# Altium schematic sheet MotorBoard.SchDoc
size Tabloid; SheetNumber: 1; SheetTotal: 1
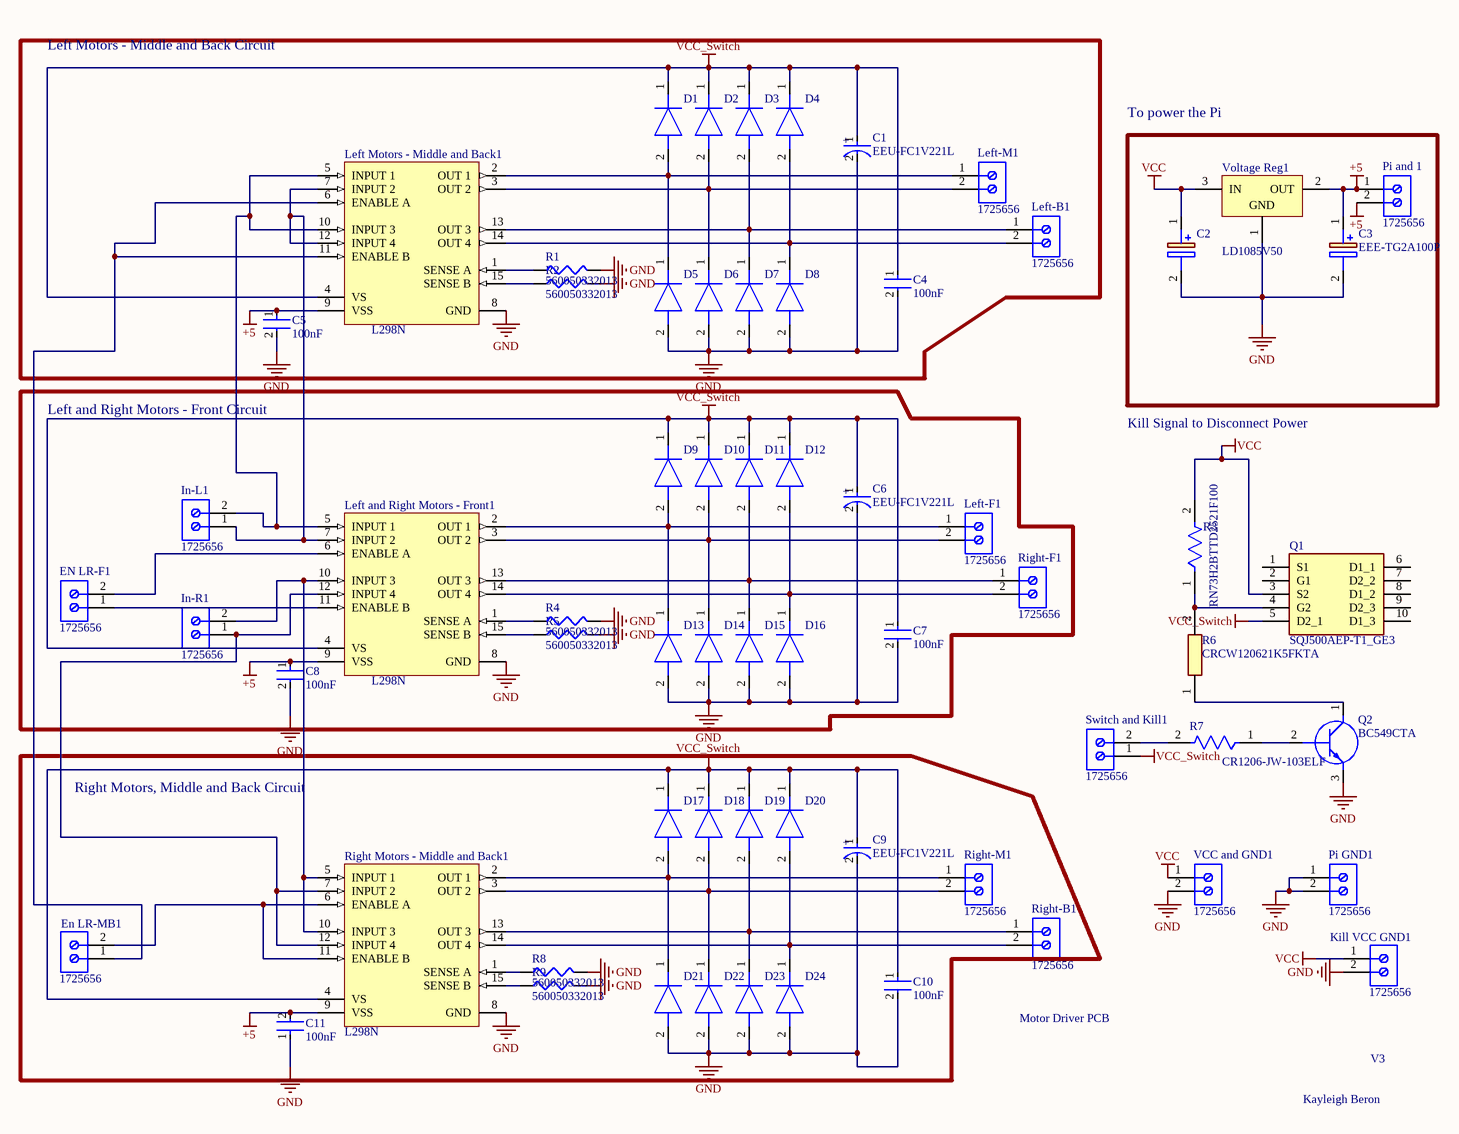
[diagram p0: MotorBoard.SchDoc]

## Parts
C1  EEU-FC1V221L  [FP-EEU-FC1V221L-MFG]
C2  EEE-TG2A100P  [CAPAE830X1050N]  (value not drawn)
C3  EEE-TG2A100P  [CAPAE830X1050N]
C4  100nF  [FP-C2012-125-0_2-MFG]
C5  100nF  [FP-C2012-125-0_2-MFG]
C6  EEU-FC1V221L  [FP-EEU-FC1V221L-MFG]
C7  100nF  [FP-C2012-125-0_2-MFG]
C8  100nF  [FP-C2012-125-0_2-MFG]
C9  EEU-FC1V221L  [FP-EEU-FC1V221L-MFG]
C10  100nF  [FP-C2012-125-0_2-MFG]
C11  100nF  [FP-C2012-125-0_2-MFG]
D1  CMR1U-02M_TR13_PBFREE  [DIOM5226X262N]  (value not drawn)
D2  CMR1U-02M_TR13_PBFREE  [DIOM5226X262N]  (value not drawn)
D3  CMR1U-02M_TR13_PBFREE  [DIOM5226X262N]  (value not drawn)
D4  CMR1U-02M_TR13_PBFREE  [DIOM5226X262N]  (value not drawn)
D5  CMR1U-02M_TR13_PBFREE  [DIOM5226X262N]  (value not drawn)
D6  CMR1U-02M_TR13_PBFREE  [DIOM5226X262N]  (value not drawn)
D7  CMR1U-02M_TR13_PBFREE  [DIOM5226X262N]  (value not drawn)
D8  CMR1U-02M_TR13_PBFREE  [DIOM5226X262N]  (value not drawn)
D9  CMR1U-02M_TR13_PBFREE  [DIOM5226X262N]  (value not drawn)
D10  CMR1U-02M_TR13_PBFREE  [DIOM5226X262N]  (value not drawn)
D11  CMR1U-02M_TR13_PBFREE  [DIOM5226X262N]  (value not drawn)
D12  CMR1U-02M_TR13_PBFREE  [DIOM5226X262N]  (value not drawn)
D13  CMR1U-02M_TR13_PBFREE  [DIOM5226X262N]  (value not drawn)
D14  CMR1U-02M_TR13_PBFREE  [DIOM5226X262N]  (value not drawn)
D15  CMR1U-02M_TR13_PBFREE  [DIOM5226X262N]  (value not drawn)
D16  CMR1U-02M_TR13_PBFREE  [DIOM5226X262N]  (value not drawn)
D17  CMR1U-02M_TR13_PBFREE  [DIOM5226X262N]  (value not drawn)
D18  CMR1U-02M_TR13_PBFREE  [DIOM5226X262N]  (value not drawn)
D19  CMR1U-02M_TR13_PBFREE  [DIOM5226X262N]  (value not drawn)
D20  CMR1U-02M_TR13_PBFREE  [DIOM5226X262N]  (value not drawn)
D21  CMR1U-02M_TR13_PBFREE  [DIOM5226X262N]  (value not drawn)
D22  CMR1U-02M_TR13_PBFREE  [DIOM5226X262N]  (value not drawn)
D23  CMR1U-02M_TR13_PBFREE  [DIOM5226X262N]  (value not drawn)
D24  CMR1U-02M_TR13_PBFREE  [DIOM5226X262N]  (value not drawn)
EN_LR-F1  1725656  [PHOE-1725656-2]
En_LR-MB1  1725656  [PHOE-1725656-2]
In-L1  1725656  [PHOE-1725656-2]
In-R1  1725656  [PHOE-1725656-2]
Kill_VCC_GND1  1725656  [PHOE-1725656-2]
Left-B1  1725656  [PHOE-1725656-2]
Left-F1  1725656  [PHOE-1725656-2]
Left-M1  1725656  [PHOE-1725656-2]
Left_and_Right_Motors_-_Front1  L298N  [STM-FM-15]
Left_Motors_-_Middle_and_Back1  L298N  [STM-FM-15]
Pi_and_1  1725656  [PHOE-1725656-2]
Pi_GND1  1725656  [PHOE-1725656-2]
Q1  SQJ500AEP-T1_GE3  [SQJB02ELPT1_GE3]
Q2  BC549CTA  [BC33740TA]
R1  560050332013  [WRIS-KSKE_1206_L3.1W1.6H0.6]
R2  560050332013  [WRIS-KSKE_1206_L3.1W1.6H0.6]
R3  RN73H2BTTD2521F100  [FP-CR1206-IPC_B]
R4  560050332013  [WRIS-KSKE_1206_L3.1W1.6H0.6]
R5  560050332013  [WRIS-KSKE_1206_L3.1W1.6H0.6]
R6  CRCW120621K5FKTA  [RESC3216X60N]
R7  CR1206-JW-103ELF  [FP-CR1206-IPC_B]
R8  560050332013  [WRIS-KSKE_1206_L3.1W1.6H0.6]
R9  560050332013  [WRIS-KSKE_1206_L3.1W1.6H0.6]
Right-B1  1725656  [PHOE-1725656-2]
Right-F1  1725656  [PHOE-1725656-2]
Right-M1  1725656  [PHOE-1725656-2]
Right_Motors_-_Middle_and_Back1  L298N  [STM-FM-15]
Switch_and_Kill1  1725656  [PHOE-1725656-2]
VCC_and_GND1  1725656  [PHOE-1725656-2]
Voltage_Reg1  LD1085V50  [TO220]

## Blocks framed on the sheet
Left Motors - Middle and Back Circuit: C1 C4 C5 D1-D8 Left-B1 Left-M1 Left_Motors_-_Middle_and_Back1 R1 R2
To power the Pi: C2 C3 Pi_and_1 Voltage_Reg1
Left and Right Motors - Front Circuit: C6-C8 D9-D16 EN_LR-F1 In-L1 In-R1 Left-F1 Left_and_Right_Motors_-_Front1 R4 R5 Right-F1
Right Motors, Middle and Back Circuit: C9-C11 D17-D24 En_LR-MB1 R8 R9 Right-B1 Right-M1 Right_Motors_-_Middle_and_Back1

## Nets
+5: C3.1(+) C5.1 C8.1 C11.2 Left_and_Right_Motors_-_Front1.9(VSS) Left_Motors_-_Middle_and_Back1.9(VSS) Pi_and_1.1 Pi_and_1.2 Right_Motors_-_Middle_and_Back1.9(VSS) Voltage_Reg1.2(OUT)
GND: C1.2(A) C2.2(-) C3.2(-) C4.2 C5.2 C6.2(A) C7.2 C8.2 C9.2(A) C10.2 C11.1 D5.2(A) D6.2(A) D7.2(A) D8.2(A) D13.2(A) D14.2(A) D15.2(A) D16.2(A) D21.2(A) D22.2(A) D23.2(A) D24.2(A) Kill_VCC_GND1.2 Left_and_Right_Motors_-_Front1.8(GND) Left_Motors_-_Middle_and_Back1.8(GND) Pi_GND1.1 Pi_GND1.2 Q2.3(E) R1.2 R2.2 R4.2 R5.2 R8.2 R9.2 Right_Motors_-_Middle_and_Back1.8(GND) VCC_and_GND1.2 Voltage_Reg1.1(GND)
VCC: C2.1(+) Kill_VCC_GND1.1 Q1.3(S2) R3.2 VCC_and_GND1.1 Voltage_Reg1.3(IN)
VCC_Switch: C1.1(C) C4.1 C6.1(C) C7.1 C9.1(C) C10.1 D1.1(K) D2.1(K) D3.1(K) D4.1(K) D9.1(K) D10.1(K) D11.1(K) D12.1(K) D17.1(K) D18.1(K) D19.1(K) D20.1(K) Left_and_Right_Motors_-_Front1.4(VS) Left_Motors_-_Middle_and_Back1.4(VS) Q1.5(D2_1) Right_Motors_-_Middle_and_Back1.4(VS) Switch_and_Kill1.1
NetD1_2: D1.2(A) D5.1(K) Left-M1.1 Left_Motors_-_Middle_and_Back1.2(OUT_1)
NetD2_2: D2.2(A) D6.1(K) Left-M1.2 Left_Motors_-_Middle_and_Back1.3(OUT_2)
NetD3_2: D3.2(A) D7.1(K) Left-B1.1 Left_Motors_-_Middle_and_Back1.13(OUT_3)
NetD4_2: D4.2(A) D8.1(K) Left-B1.2 Left_Motors_-_Middle_and_Back1.14(OUT_4)
NetD9_2: D9.2(A) D13.1(K) Left-F1.1 Left_and_Right_Motors_-_Front1.2(OUT_1)
NetD10_2: D10.2(A) D14.1(K) Left-F1.2 Left_and_Right_Motors_-_Front1.3(OUT_2)
NetD11_2: D11.2(A) D15.1(K) Left_and_Right_Motors_-_Front1.13(OUT_3) Right-F1.1
NetD12_2: D12.2(A) D16.1(K) Left_and_Right_Motors_-_Front1.14(OUT_4) Right-F1.2
NetD17_2: D17.2(A) D21.1(K) Right-M1.1 Right_Motors_-_Middle_and_Back1.2(OUT_1)
NetD18_2: D18.2(A) D22.1(K) Right-M1.2 Right_Motors_-_Middle_and_Back1.3(OUT_2)
NetD19_2: D19.2(A) D23.1(K) Right-B1.1 Right_Motors_-_Middle_and_Back1.13(OUT_3)
NetD20_2: D20.2(A) D24.1(K) Right-B1.2 Right_Motors_-_Middle_and_Back1.14(OUT_4)
NetEN_LR-F1_1: EN_LR-F1.1 Left_and_Right_Motors_-_Front1.11(ENABLE_B)
NetEN_LR-F1_2: EN_LR-F1.2 Left_and_Right_Motors_-_Front1.6(ENABLE_A)
NetEn_LR-MB1_1: En_LR-MB1.1 Left_Motors_-_Middle_and_Back1.6(ENABLE_A) Left_Motors_-_Middle_and_Back1.11(ENABLE_B)
NetEn_LR-MB1_2: En_LR-MB1.2 Right_Motors_-_Middle_and_Back1.6(ENABLE_A) Right_Motors_-_Middle_and_Back1.11(ENABLE_B)
NetIn-L1_1: In-L1.1 Left_and_Right_Motors_-_Front1.7(INPUT_2) Left_Motors_-_Middle_and_Back1.7(INPUT_2) Left_Motors_-_Middle_and_Back1.12(INPUT_4)
NetIn-L1_2: In-L1.2 Left_and_Right_Motors_-_Front1.5(INPUT_1) Left_Motors_-_Middle_and_Back1.5(INPUT_1) Left_Motors_-_Middle_and_Back1.10(INPUT_3)
NetIn-R1_1: In-R1.1 Left_and_Right_Motors_-_Front1.12(INPUT_4) Right_Motors_-_Middle_and_Back1.7(INPUT_2) Right_Motors_-_Middle_and_Back1.12(INPUT_4)
NetIn-R1_2: In-R1.2 Left_and_Right_Motors_-_Front1.10(INPUT_3) Right_Motors_-_Middle_and_Back1.5(INPUT_1) Right_Motors_-_Middle_and_Back1.10(INPUT_3)
NetLeft_and_Right_Motors_-_Front1_1: Left_and_Right_Motors_-_Front1.1(SENSE_A) R4.1
NetLeft_and_Right_Motors_-_Front1_15: Left_and_Right_Motors_-_Front1.15(SENSE_B) R5.1
NetLeft_Motors_-_Middle_and_Back1_1: Left_Motors_-_Middle_and_Back1.1(SENSE_A) R1.1
NetLeft_Motors_-_Middle_and_Back1_15: Left_Motors_-_Middle_and_Back1.15(SENSE_B) R2.1
NetQ1_4: Q1.4(G2) R3.1 R6.2
NetQ2_1: Q2.1(C) R6.1
NetQ2_2: Q2.2(B) R7.1
NetR7_2: R7.2 Switch_and_Kill1.2
NetR8_1: R8.1 Right_Motors_-_Middle_and_Back1.1(SENSE_A)
NetR9_1: R9.1 Right_Motors_-_Middle_and_Back1.15(SENSE_B)

Not connected (* = marked no-connect by the designer): Q1 1(S1) 2(G1) 6(D1_1) 7(D2_2) 8(D1_2) 9(D2_3) 10(D1_3)

## Notes on the sheet
- Kill Signal to Disconnect Power
- Motor Driver PCB
- V3
- Kayleigh Beron
- (in symbol CMP-05427-000010-1) +

## Library data of the parts
C1 C6 C9 = CMP-05427-000010-1: CAP ALUM 220UF 20% 35V RADIAL; Manufacturer: Panasonic Electronic Components; Material: Aluminum; Leakage Current: 77uA; Esr: 0.085Ω; Life: 2000Hours; Automotive Grade: Grade 2; Dissipation Factor: 12%; Ripple Current: 730mA; Octopart: https://octopart.com/eeu-fc1v221l-panasonic-39478519; ComponentLink2URL: https://industrial.panasonic.com/cdbs/www-data/pdf/RDF0000/ABA0000C1209.pdf; Package: 0; Height: 16.5mm; Category: Cap; Value: 220uF; ComponentLink2Description: Datasheet; Lead Free: Yes; Device Class L2: Capacitors; Temperature Range High: +105°C; Mouser Description: Capacitor; Aluminum Electrolytic; Fc Radial Elec Cap 220uF 35V; Temperature: -55°C to +105°C; Digikey Description: CAP ALUM 220UF 20% 35V RADIAL; Device Class L3: Aluminum Electrolytic Capacitors; Manufacturer Part Number: EEU-FC1V221L; Device Class L1: Passive Components; Automotive: Yes; RoHS: TRUE; Temperature Range Low: -55°C; Capacitance: 220uF; Voltage Rating: 35V; Tolerance: 20%
C2 C3 = EEE-TG2A100P: Capacitor Polarised; Manufacturer_Name: Panasonic; Datasheet Link: http://industrial.panasonic.com/cdbs/www-data/pdf/RDE0000/ABA0000C1187.pdf; Height: 10.5mm; Manufacturer_Part_Number: EEE-TG2A100P; Mouser Part Number: 667-EEE-TG2A100P; Mouser Price/Stock: https://www.mouser.co.uk/ProductDetail/Panasonic/EEE-TG2A100P?qs=aAAGLDy8P2zc4TwQCeoTrg%3D%3D; Arrow Part Number: EEE-TG2A100P; Arrow Price/Stock: https://www.arrow.com/en/products/eee-tg2a100p/panasonic?region=nac
C4 C5 C7 C8 C10 C11 = CMP-08246-005122-1: Multilayer Ceramic Capacitors 100nF ±10% 50V X8R SMD 0805; Case/Package: 0805; Dielectric: X8R; Case Code (Metric): 2012; Height: 1.25mm; REACH SVHC: No SVHC; Capacitance: 100nF; Series: C; Voltage Rating (DC): 50V; Tolerance: 10%; Depth: 1.25mm; Voltage Rating: 50V; Thickness: 0.057inch; RoHS Compliant: Yes; Termination: SMD/SMT; Weight: 0.000194oz; Width: 0.049inch; Mount: Surface Mount; Max Operating Temperature: 150°C; Features: High Temperature; Min Operating Temperature: -55°C; Lead Free: Lead Free; Packaging: Tape and Reel; Resistor Type: Ceramic; Case Code (Imperial): 0805; Package Quantity: 1; Length: 2mm
D1-D24 = CMR1U-02M_TR13_PBFREE: Diode; Manufacturer_Name: Central Semiconductor; Manufacturer_Part_Number: CMR1U-02M TR13 PBFREE; Datasheet Link: https://my.centralsemi.com/datasheets/CMR1U01M.PDF; Height: 2.62mm; Mouser Part Number: 610-CMR1U-02M; Mouser Price/Stock: https://www.mouser.co.uk/ProductDetail/Central-Semiconductor/CMR1U-02M-TR13-PBFREE?qs=u16ybLDytRYak6CMIjk9oA%3D%3D; Arrow Part Number: CMR1U-02M TR13 PBFREE; Arrow Price/Stock: https://www.arrow.com/en/products/cmr1u-02m-tr13-pbfree/central-semiconductor?region=nac
EN_LR-F1 En_LR-MB1 In-L1 In-R1 Kill_VCC_GND1 Left-B1 Left-F1 Left-M1 Pi_and_1 Pi_GND1 Right-B1 Right-F1 Right-M1 Switch_and_Kill1 VCC_and_GND1 = CMP-2000-05299-1: Male Header, Pitch 2.54 mm, 1 x 2 Position, Height 9 mm, Tail Length 3.5 mm; Manufacturer: Phoenix Contact; Number of contacts: 2; Content: 250pc(s); Pitch: 2.54mm; Industrial packaging: Yes; Colour: Green; Manufacturer part No.: 1725656; Type: MPT0,5/2-2,54; Datasheet URL: http://datasheet.octopart.com/1725656-Phoenix-Contact-datasheet-5302866.pdf; Manufacturer URL: http://www.phoenixcontact.com/; Datasheet Version: Apr-08
Left_and_Right_Motors_-_Front1 Left_Motors_-_Middle_and_Back1 Right_Motors_-_Middle_and_Back1 = CMP-2000-06526-1: Dual Full-Bridge Driver, 4.8 to 46 V, -40 to 150 degC, 15-Pin FM (MW 15L), RoHS, Tube; Manufacturer: STMicroelectronics; PartNumber: L298; Output Current: 2A; Supply Voltage Max: 7V; Driver Case Style: Multiwatt; Supply Voltage Min: 4.5V; No. of Pins: 15Pins; SVHC: NoSVHC(17-Dec-2015); Output Voltage: 46V; No. of Outputs: 4Outputs; Motor Type: FullBridge; MSL: -; Package Description: 15-Pin Flange Mount, Body 5 x 19.6 mm, Pitch 1.27 mm; Datasheet Version: 01/2000; Package Reference: FM-15; Mounting Technology: ThroughHole; Packaging: Each; Automotive Qualification Standard: -; Product Range: -; Datasheet URL: https://datasheet.ciiva.com/15109/getdatasheetpartid-50682-15109332.pdf; Operating Temperature Max: 130°C; Operating Temperature Min: -25°C; Manufacturer URL: http://www.st.com/
Q1 = SQJ500AEP-T1_GE3: MOSFET (N-Channel); Manufacturer_Name: Vishay; Datasheet Link: http://www.mouser.com/ds/2/427/sqj500aep-740737.pdf; Height: 1.267mm; Manufacturer_Part_Number: SQJ500AEP-T1_GE3; Mouser Part Number: 78-SQJ500AEP-T1_GE3; Mouser Price/Stock: https://www.mouser.com/Search/Refine.aspx?Keyword=78-SQJ500AEP-T1_GE3
Q2 = BC549CTA: Transistor BJT NPN; Manufacturer_Name: onsemi; Datasheet Link: https://www.onsemi.com/pub/Collateral/BC550-D.pdf; Manufacturer_Part_Number: BC549CTA; Mouser Part Number: 512-BC549CTA; Mouser Price/Stock: https://www.mouser.co.uk/ProductDetail/onsemi-Fairchild/BC549CTA?qs=UMEuL5FsraA9pebzi3Uf7w%3D%3D; Arrow Part Number: BC549CTA; Arrow Price/Stock: https://www.arrow.com/en/products/bc549cta/on-semiconductor?utm_currency=USD&region=europe
R1 R2 R4 R5 R8 R9 = CMP-03913-100810073-1: 560050332013 Res, R5, 1%, 0.5W, Thick Film, 1206 Rohs Compliant: Yes; Voltage Rating: 500mV; Resistance: 500mΩ; Current Rating: 1A; RoHS: Compliant; Min Operating Temperature: -55°C; Width: 1.6mm; Max Operating Temperature: 155°C; Length: 3.1mm; NexarPartId: 100810073; Height: 600µm
R3 R7 = CMP-07231-005593-1: Thick Film Chip Resistors 1206 10kΩ 0.25W 5% 200ppm/°C; Voltage Rating: 200V; Resistance: 10kR; Max Power Dissipation: 250mW; Temperature Coefficient: 200ppm/°C; Height: 0.6mm; Case Code (Imperial): 1206; REACH SVHC: No SVHC; Depth: 1.6mm; Mount: Surface Mount; Termination: SMD/SMT; Case/Package: 1206; Min Operating Temperature: -55°C; Features: Moisture Resistant; Number of Pins: 2; Length: 3.2mm; Military Standard: Not; Radiation Hardening: No; Max Operating Temperature: 155°C; Power Rating: 250mW; Case Code (Metric): 3216; Package Quantity: 1; Composition: Thick Film; Tolerance: 5%; Voltage Rating (DC): 200V; Contact Plating: Tin; Thickness: 610um; Number of Terminations: 2; Packaging: Tape and Reel; Width: 1.6mm
R6 = CRCW120621K5FKTA: Resistor; Manufacturer_Name: Vishay; Height: 0.6mm; Manufacturer_Part_Number: CRCW120621K5FKTA; Mouser Part Number: 71-CRCW1206-21.5K; Mouser Price/Stock: https://www.mouser.co.uk/ProductDetail/Vishay-Dale/CRCW120621K5FKTA?qs=HpYJtD%2F%252BJmJ2NUdKZqmEMg%3D%3D
Voltage_Reg1 = CMP-0244-00494-1: 3A, Low Drop Positive Voltage Regulator, 5V, 3-Pin TO-220; ComponentLink1URL: http://www.st.com; PackageDescription: TO, Thru-Hole, Vertical, Heatsink Mounted; 3 In-Line Leads; Pitch 2.54 mm; DatasheetVersion: 28/07/2009; PackageVersion: ver3.0; ComponentLink2URL: http://www.st.com/internet/com/TECHNICAL_RESOURCES/TECHNICAL_LITERATURE/DATASHEET/CD00001883.pdf; ComponentLink1Description: Manufacturer URL; PackageReference: TO220; ComponentLink2Description: Datasheet; ComponentLink3URL: http://www.st.com/internet/com/TECHNICAL_RESOURCES/TECHNICAL_LITERATURE/PACKAGE_INFORMATION/CD00004649.pdf; ComponentLink3Description: Package Specification